# Altium schematic sheet LPDDR4 SDRAM_1.SchDoc: RK3399 COB Design V1.0
size A3; Author: ABC; Organization: Altium Limited; Address1: L3, 12a Rodborough Rd; Address2: Frenchs Forest; Address3: NSW; Address4: Australia 2086; DocumentNumber: 5; SheetNumber: 5; SheetTotal: 27; PROJECT CODE: A_V1.0
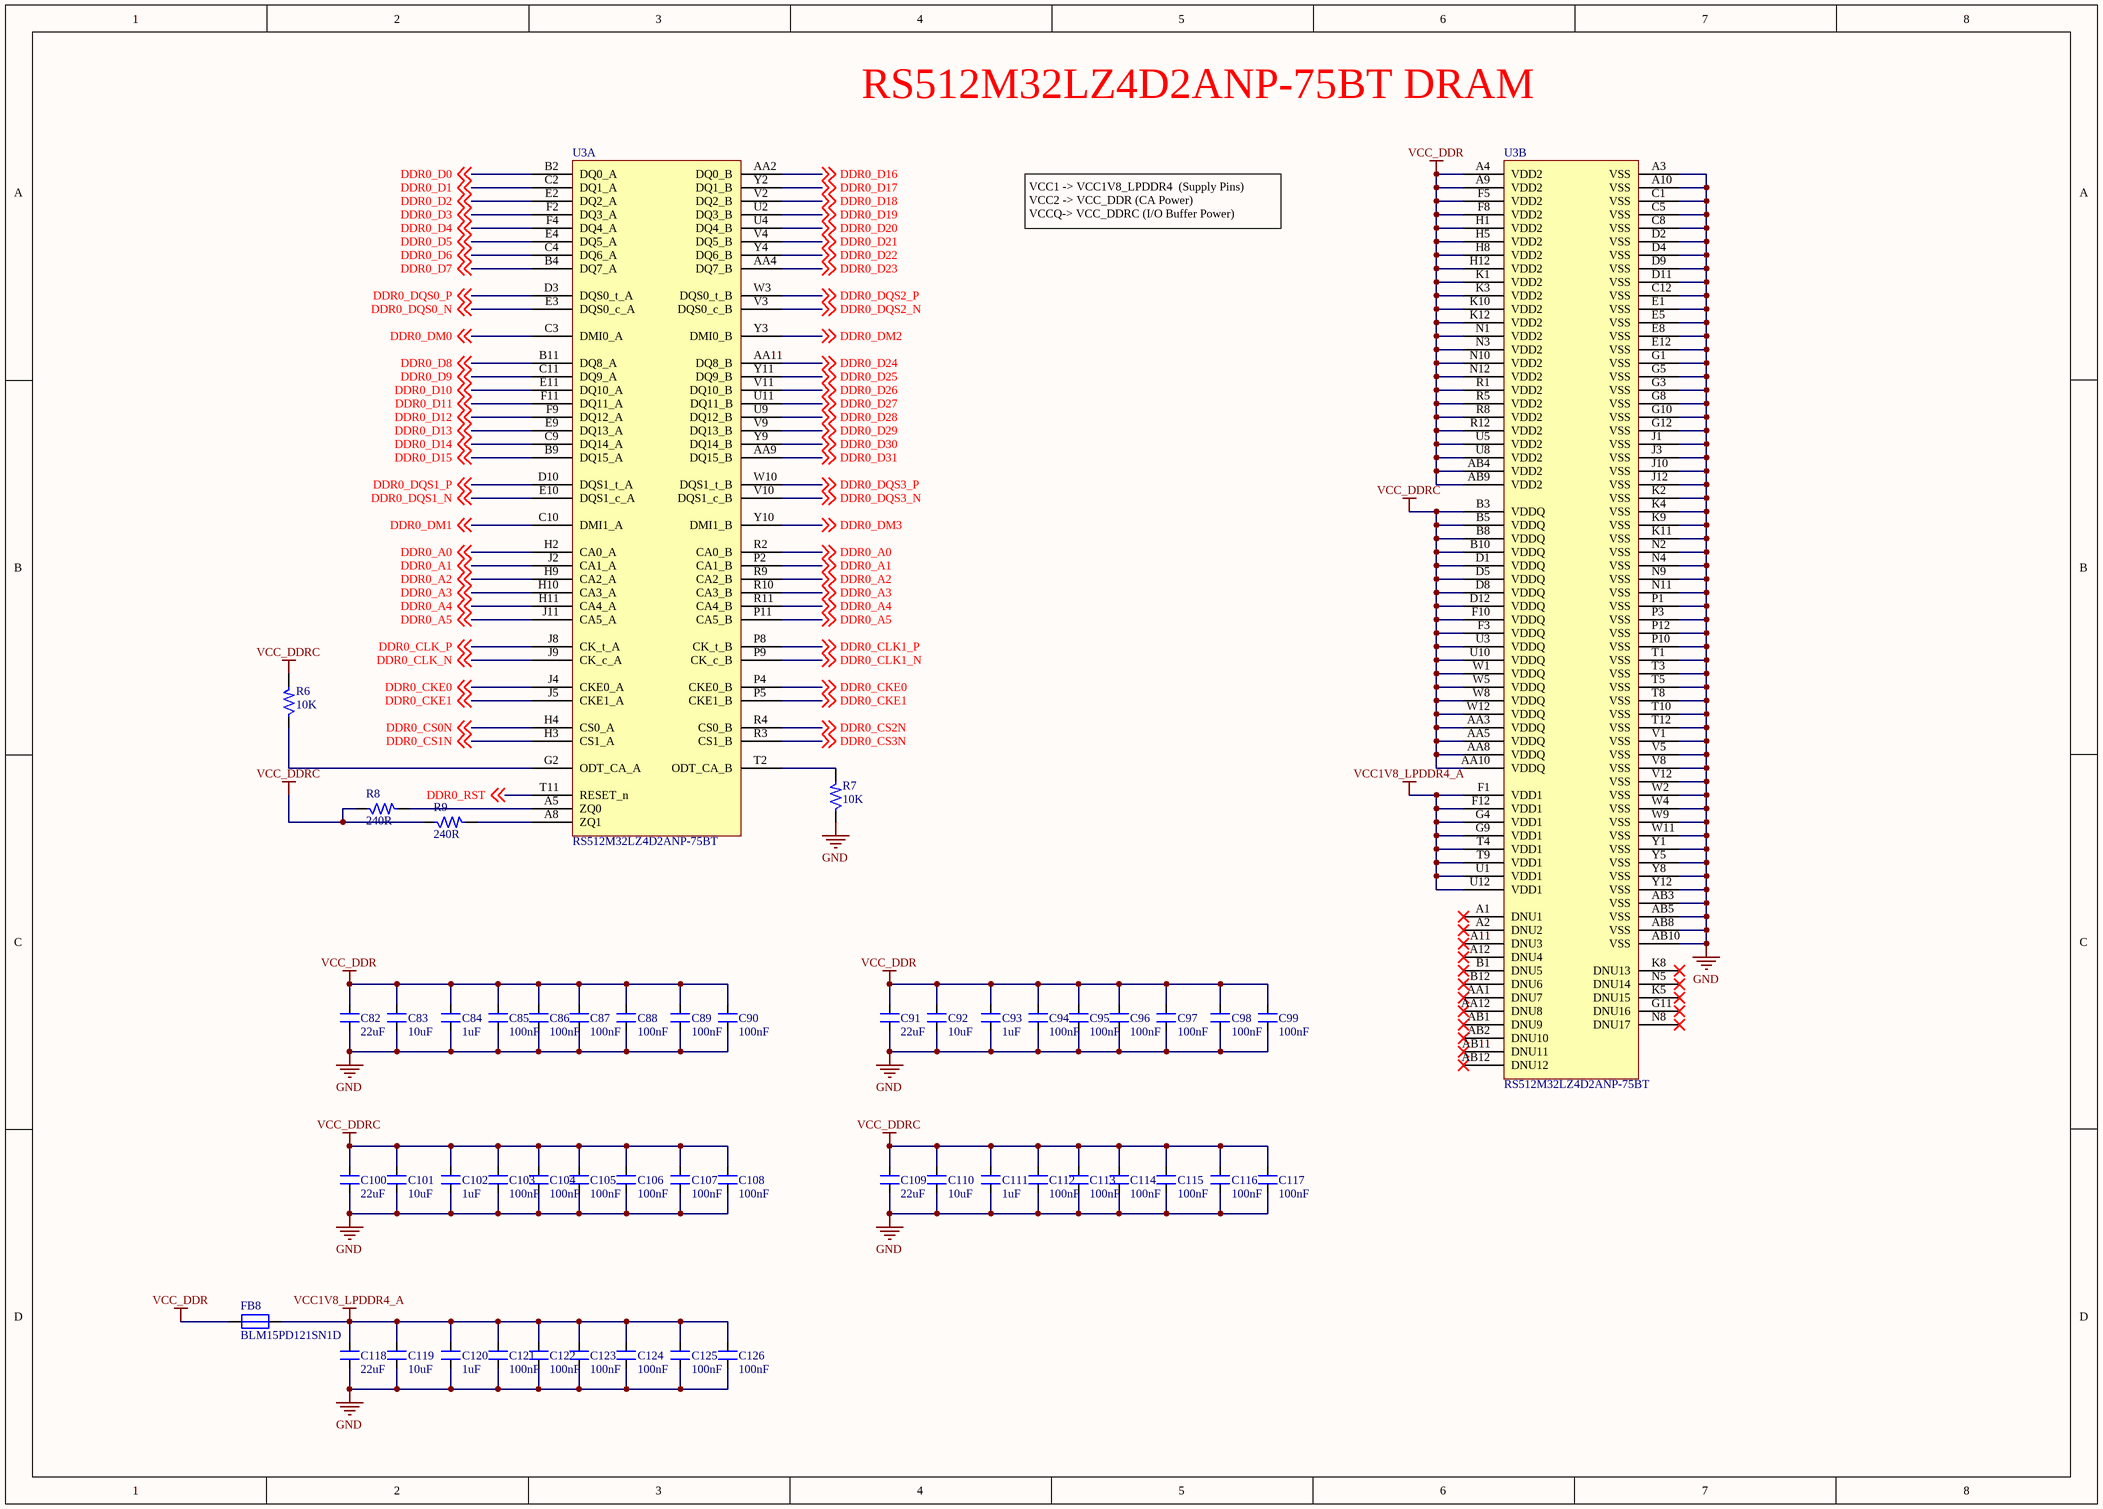
[diagram p0: LPDDR4 SDRAM_1.SchDoc]

## Parts
C82  22uF  [CAP_0402]
C83  10uF  [CAP_0402]
C84  1uF  [CAP_0201]
C85  100nF  [CAP_0201]
C86  100nF  [CAP_0201]
C87  100nF  [CAP_0201]
C88  100nF  [CAP_0201]
C89  100nF  [CAP_0201]
C90  100nF  [CAP_0201]
C91  22uF  [CAP_0402]
C92  10uF  [CAP_0402]
C93  1uF  [CAP_0201]
C94  100nF  [CAP_0201]
C95  100nF  [CAP_0201]
C96  100nF  [CAP_0201]
C97  100nF  [CAP_0201]
C98  100nF  [CAP_0201]
C99  100nF  [CAP_0201]
C100  22uF  [CAP_0402]
C101  10uF  [CAP_0402]
C102  1uF  [CAP_0201]
C103  100nF  [CAP_0201]
C104  100nF  [CAP_0201]
C105  100nF  [CAP_0201]
C106  100nF  [CAP_0201]
C107  100nF  [CAP_0201]
C108  100nF  [CAP_0201]
C109  22uF  [CAP_0402]
C110  10uF  [CAP_0402]
C111  1uF  [CAP_0201]
C112  100nF  [CAP_0201]
C113  100nF  [CAP_0201]
C114  100nF  [CAP_0201]
C115  100nF  [CAP_0201]
C116  100nF  [CAP_0201]
C117  100nF  [CAP_0201]
C118  22uF  [CAP_0402]
C119  10uF  [CAP_0402]
C120  1uF  [CAP_0201]
C121  100nF  [CAP_0201]
C122  100nF  [CAP_0201]
C123  100nF  [CAP_0201]
C124  100nF  [CAP_0201]
C125  100nF  [CAP_0201]
C126  100nF  [CAP_0201]
FB8  BLM15PD121SN1D  [RES_0402]
R6  10K  [RES_0201]
R7  10K  [RES_0201]
R8  240R  [RES_0201]
R9  240R  [RES_0201]
U3  RS512M32LZ4D2ANP-75BT  [FBGA200_SMD]  (parts A,B of 2)

## Nets
GND: C82.1 C83.1 C84.1 C85.1 C86.1 C87.1 C88.1 C89.1 C90.1 C91.1 C92.1 C93.1 C94.1 C95.1 C96.1 C97.1 C98.1 C99.1 C100.1 C101.1 C102.1 C103.1 C104.1 C105.1 C106.1 C107.1 C108.1 C109.1 C110.1 C111.1 C112.1 C113.1 C114.1 C115.1 C116.1 C117.1 C118.1 C119.1 C120.1 C121.1 C122.1 C123.1 C124.1 C125.1 C126.1 R7.1 U3.A3(VSS) U3.A10(VSS) U3.AB3(VSS) U3.AB5(VSS) U3.AB8(VSS) U3.AB10(VSS) U3.C1(VSS) U3.C5(VSS) U3.C8(VSS) U3.C12(VSS) U3.D2(VSS) U3.D4(VSS) U3.D9(VSS) U3.D11(VSS) U3.E1(VSS) U3.E5(VSS) U3.E8(VSS) U3.E12(VSS) U3.G1(VSS) U3.G3(VSS) U3.G5(VSS) U3.G8(VSS) U3.G10(VSS) U3.G12(VSS) U3.J1(VSS) U3.J3(VSS) U3.J10(VSS) U3.J12(VSS) U3.K2(VSS) U3.K4(VSS) U3.K9(VSS) U3.K11(VSS) U3.N2(VSS) U3.N4(VSS) U3.N9(VSS) U3.N11(VSS) U3.P1(VSS) U3.P3(VSS) U3.P10(VSS) U3.P12(VSS) U3.T1(VSS) U3.T3(VSS) U3.T5(VSS) U3.T8(VSS) U3.T10(VSS) U3.T12(VSS) U3.V1(VSS) U3.V5(VSS) U3.V8(VSS) U3.V12(VSS) U3.W2(VSS) U3.W4(VSS) U3.W9(VSS) U3.W11(VSS) U3.Y1(VSS) U3.Y5(VSS) U3.Y8(VSS) U3.Y12(VSS)
VCC1V8_LPDDR4_A: C118.2 C119.2 C120.2 C121.2 C122.2 C123.2 C124.2 C125.2 C126.2 FB8.2 U3.F1(VDD1) U3.F12(VDD1) U3.G4(VDD1) U3.G9(VDD1) U3.T4(VDD1) U3.T9(VDD1) U3.U1(VDD1) U3.U12(VDD1)
VCC_DDR: C82.2 C83.2 C84.2 C85.2 C86.2 C87.2 C88.2 C89.2 C90.2 C91.2 C92.2 C93.2 C94.2 C95.2 C96.2 C97.2 C98.2 C99.2 FB8.1 U3.A4(VDD2) U3.A9(VDD2) U3.AB4(VDD2) U3.AB9(VDD2) U3.F5(VDD2) U3.F8(VDD2) U3.H1(VDD2) U3.H5(VDD2) U3.H8(VDD2) U3.H12(VDD2) U3.K1(VDD2) U3.K3(VDD2) U3.K10(VDD2) U3.K12(VDD2) U3.N1(VDD2) U3.N3(VDD2) U3.N10(VDD2) U3.N12(VDD2) U3.R1(VDD2) U3.R5(VDD2) U3.R8(VDD2) U3.R12(VDD2) U3.U5(VDD2) U3.U8(VDD2)
VCC_DDRC: C100.2 C101.2 C102.2 C103.2 C104.2 C105.2 C106.2 C107.2 C108.2 C109.2 C110.2 C111.2 C112.2 C113.2 C114.2 C115.2 C116.2 C117.2 R6.2 R8.1 R9.1 U3.AA3(VDDQ) U3.AA5(VDDQ) U3.AA8(VDDQ) U3.AA10(VDDQ) U3.B3(VDDQ) U3.B5(VDDQ) U3.B8(VDDQ) U3.B10(VDDQ) U3.D1(VDDQ) U3.D5(VDDQ) U3.D8(VDDQ) U3.D12(VDDQ) U3.F3(VDDQ) U3.F10(VDDQ) U3.U3(VDDQ) U3.U10(VDDQ) U3.W1(VDDQ) U3.W5(VDDQ) U3.W8(VDDQ) U3.W12(VDDQ)
DDR0_A0: U3.H2(CA0_A) U3.R2(CA0_B) ; off-sheet DDR0_A0
DDR0_A1: U3.J2(CA1_A) U3.P2(CA1_B) ; off-sheet DDR0_A1
DDR0_A2: U3.H9(CA2_A) U3.R9(CA2_B) ; off-sheet DDR0_A2
DDR0_A3: U3.H10(CA3_A) U3.R10(CA3_B) ; off-sheet DDR0_A3
DDR0_A4: U3.H11(CA4_A) U3.R11(CA4_B) ; off-sheet DDR0_A4
DDR0_A5: U3.J11(CA5_A) U3.P11(CA5_B) ; off-sheet DDR0_A5
DDR0_CKE0: U3.J4(CKE0_A) U3.P4(CKE0_B) ; off-sheet DDR0_CKE0
DDR0_CKE1: U3.J5(CKE1_A) U3.P5(CKE1_B) ; off-sheet DDR0_CKE1
DDR0_CLK1_N: U3.P9(CK_c_B) ; off-sheet DDR0_CLK1_N
DDR0_CLK1_P: U3.P8(CK_t_B) ; off-sheet DDR0_CLK1_P
DDR0_CLK_N: U3.J9(CK_c_A) ; off-sheet DDR0_CLK_N
DDR0_CLK_P: U3.J8(CK_t_A) ; off-sheet DDR0_CLK_P
DDR0_CS0N: U3.H4(CS0_A) ; off-sheet DDR0_CS0N
DDR0_CS1N: U3.H3(CS1_A) ; off-sheet DDR0_CS1N
DDR0_CS2N: U3.R4(CS0_B) ; off-sheet DDR0_CS2N
DDR0_CS3N: U3.R3(CS1_B) ; off-sheet DDR0_CS3N
DDR0_D0: U3.B2(DQ0_A) ; off-sheet DDR0_D0
DDR0_D1: U3.C2(DQ1_A) ; off-sheet DDR0_D1
DDR0_D2: U3.E2(DQ2_A) ; off-sheet DDR0_D2
DDR0_D3: U3.F2(DQ3_A) ; off-sheet DDR0_D3
DDR0_D4: U3.F4(DQ4_A) ; off-sheet DDR0_D4
DDR0_D5: U3.E4(DQ5_A) ; off-sheet DDR0_D5
DDR0_D6: U3.C4(DQ6_A) ; off-sheet DDR0_D6
DDR0_D7: U3.B4(DQ7_A) ; off-sheet DDR0_D7
DDR0_D8: U3.B11(DQ8_A) ; off-sheet DDR0_D8
DDR0_D9: U3.C11(DQ9_A) ; off-sheet DDR0_D9
DDR0_D10: U3.E11(DQ10_A) ; off-sheet DDR0_D10
DDR0_D11: U3.F11(DQ11_A) ; off-sheet DDR0_D11
DDR0_D12: U3.F9(DQ12_A) ; off-sheet DDR0_D12
DDR0_D13: U3.E9(DQ13_A) ; off-sheet DDR0_D13
DDR0_D14: U3.C9(DQ14_A) ; off-sheet DDR0_D14
DDR0_D15: U3.B9(DQ15_A) ; off-sheet DDR0_D15
DDR0_D16: U3.AA2(DQ0_B) ; off-sheet DDR0_D16
DDR0_D17: U3.Y2(DQ1_B) ; off-sheet DDR0_D17
DDR0_D18: U3.V2(DQ2_B) ; off-sheet DDR0_D18
DDR0_D19: U3.U2(DQ3_B) ; off-sheet DDR0_D19
DDR0_D20: U3.U4(DQ4_B) ; off-sheet DDR0_D20
DDR0_D21: U3.V4(DQ5_B) ; off-sheet DDR0_D21
DDR0_D22: U3.Y4(DQ6_B) ; off-sheet DDR0_D22
DDR0_D23: U3.AA4(DQ7_B) ; off-sheet DDR0_D23
DDR0_D24: U3.AA11(DQ8_B) ; off-sheet DDR0_D24
DDR0_D25: U3.Y11(DQ9_B) ; off-sheet DDR0_D25
DDR0_D26: U3.V11(DQ10_B) ; off-sheet DDR0_D26
DDR0_D27: U3.U11(DQ11_B) ; off-sheet DDR0_D27
DDR0_D28: U3.U9(DQ12_B) ; off-sheet DDR0_D28
DDR0_D29: U3.V9(DQ13_B) ; off-sheet DDR0_D29
DDR0_D30: U3.Y9(DQ14_B) ; off-sheet DDR0_D30
DDR0_D31: U3.AA9(DQ15_B) ; off-sheet DDR0_D31
DDR0_DM0: U3.C3(DMI0_A) ; off-sheet DDR0_DM0
DDR0_DM1: U3.C10(DMI1_A) ; off-sheet DDR0_DM1
DDR0_DM2: U3.Y3(DMI0_B) ; off-sheet DDR0_DM2
DDR0_DM3: U3.Y10(DMI1_B) ; off-sheet DDR0_DM3
DDR0_DQS0_N: U3.E3(DQS0_c_A) ; off-sheet DDR0_DQS0_N
DDR0_DQS0_P: U3.D3(DQS0_t_A) ; off-sheet DDR0_DQS0_P
DDR0_DQS1_N: U3.E10(DQS1_c_A) ; off-sheet DDR0_DQS1_N
DDR0_DQS1_P: U3.D10(DQS1_t_A) ; off-sheet DDR0_DQS1_P
DDR0_DQS2_N: U3.V3(DQS0_c_B) ; off-sheet DDR0_DQS2_N
DDR0_DQS2_P: U3.W3(DQS0_t_B) ; off-sheet DDR0_DQS2_P
DDR0_DQS3_N: U3.V10(DQS1_c_B) ; off-sheet DDR0_DQS3_N
DDR0_DQS3_P: U3.W10(DQS1_t_B) ; off-sheet DDR0_DQS3_P
DDR0_RST: U3.T11(RESET_n) ; off-sheet DDR0_RST
NetR6_1: R6.1 U3.G2(ODT_CA_A)
NetR7_2: R7.2 U3.T2(ODT_CA_B)
NetR8_2: R8.2 U3.A5(ZQ0)
NetR9_2: R9.2 U3.A8(ZQ1)

Not connected (* = marked no-connect by the designer): U3 A1(DNU1)* A2(DNU2)* A11(DNU3)* A12(DNU4)* AA1(DNU7)* AA12(DNU8)* AB1(DNU9)* AB2(DNU10)* AB11(DNU11)* AB12(DNU12)* B1(DNU5)* B12(DNU6)* G11(DNU16)* K5(DNU15)* K8(DNU13)* N5(DNU14)* N8(DNU17)*

## Notes on the sheet
- RS512M32LZ4D2ANP-75BT DRAM
- VCC1 -> VCC1V8_LPDDR4  (Supply Pins)
  VCC2 -> VCC_DDR (CA Power)
  VCCQ-> VCC_DDRC (I/O Buffer Power)
- TITLE:
- DOCUMENT NAME:
- SCALE 1:1
- This document is copyright of Esteempcb and shall not be revealed, produced, copied, in whole or in part, nor
- PROJECT CODE:
- TEMPLATE:
- A3
- AUTHOR:
- Sheet
- of
- used for any purpose other than submitted.

## Library data of the parts
C82 C91 C100 C109 C118 = CAP_22uF-6.3V-20%-0402: 22µF ±20% 6.3V Ceramic Capacitor X5R 0402 (1005 Metric) /; Manufacturer: Murata Electronics; Manufacturer Part Number: CL05A226MQ5N6J8; Case/Package: 0402; Supplier-1: Digikey
C83 C92 C101 C110 C119 = CAP_10uF-10V-20%-0402: 10µF ±20% 10V Ceramic Capacitor X5R 0402 (1005 Metric) /; Manufacturer Part Number: CL05A106MP5NUNC; Manufacturer: Samsung Electro-Mechanics; Case/Package: 0402; Supplier-1: Digikey
C84 C93 C102 C111 C120 = CAP_1uF-16V-10%-0201: 1µF ±20% 16V Ceramic Capacitor X5R 0201 (0603 Metric) /; Manufacturer: Samsung Electro-Mechanics; Manufacturer Part Number: CL03A105MO3NRNH; Case/Package: 0201; Supplier-1: Digikey
C85-C90 C94-C99 C103-C108 C112-C117 C121-C126 = CAP_100nF-25V-10%-0201: 0.1µF ±10% 25V Ceramic Capacitor X5R 0201 (0603 Metric) /; Manufacturer: TDK Corporation; Manufacturer Part Number: C0603X5R1E104K030BB; Case/Package: 0201; Supplier-1: Digikey
FB8 = FB_120R-1.3A-100Mhz-0402: 120 Ohms @ 100MHz 1 Power Line Ferrite Bead 0402 (1005 Metric) 1.3A 90mOhm; Manufacturer: Murata Electronics; Mnaufacturer Part Number: BLM15PD121SN1D; Case/Package: 0402; Supplier-1: Digikey
R6 R7 = RES_10K-0.05W-1%-0201: 10 kOhms ±1% 0.05W, 1/20W Chip Resistor 0201 (0603 Metric) Thick Film /; Manufacturer: Stackpole Electronics Inc; Manufacturer Part Number: RMCF0201FT10K0; Case/Package: 0201; Supplier-1: Digikey
R8 R9 = RES_240R-0.05W-1%-0201: 240 Ohms ±1% 0.05W, 1/20W Chip Resistor 0201 (0603 Metric) Thick Film /; Manufacturer: Yageo; Manufacturer Part Number: RC0201FR-07240RL; Case/Package: 0201; Supplier-1: Digikey
U3 = IC_RS512M32LZ4D2ANP-75BT: LPDDR4/4X Package FBGA 200b Density 4Gbit~64Gbit Operating Temperature Range：-25~85℃ Speed：2667Mbps/3200Mbps/3733Mbps Voltage：VDD1/VDD2/VDDQ= 1.8 / 1.1 / 1.1 V（LPDDR4）VDD1/VDD2/VDDQ = 1.8 / 1.1 / 0.6 V（LPDDR4X）Approved Verification Platform：MTK、Spreadtrum; Manufacturer: RAYSON; Manufacturer Part Number: RS512M32LZ4D2ANP-75BT; Case/Package: FBGA 200b; Supplier-1: RAYSON